# EAGLE schematic Board (EAGLE 6.5.0)
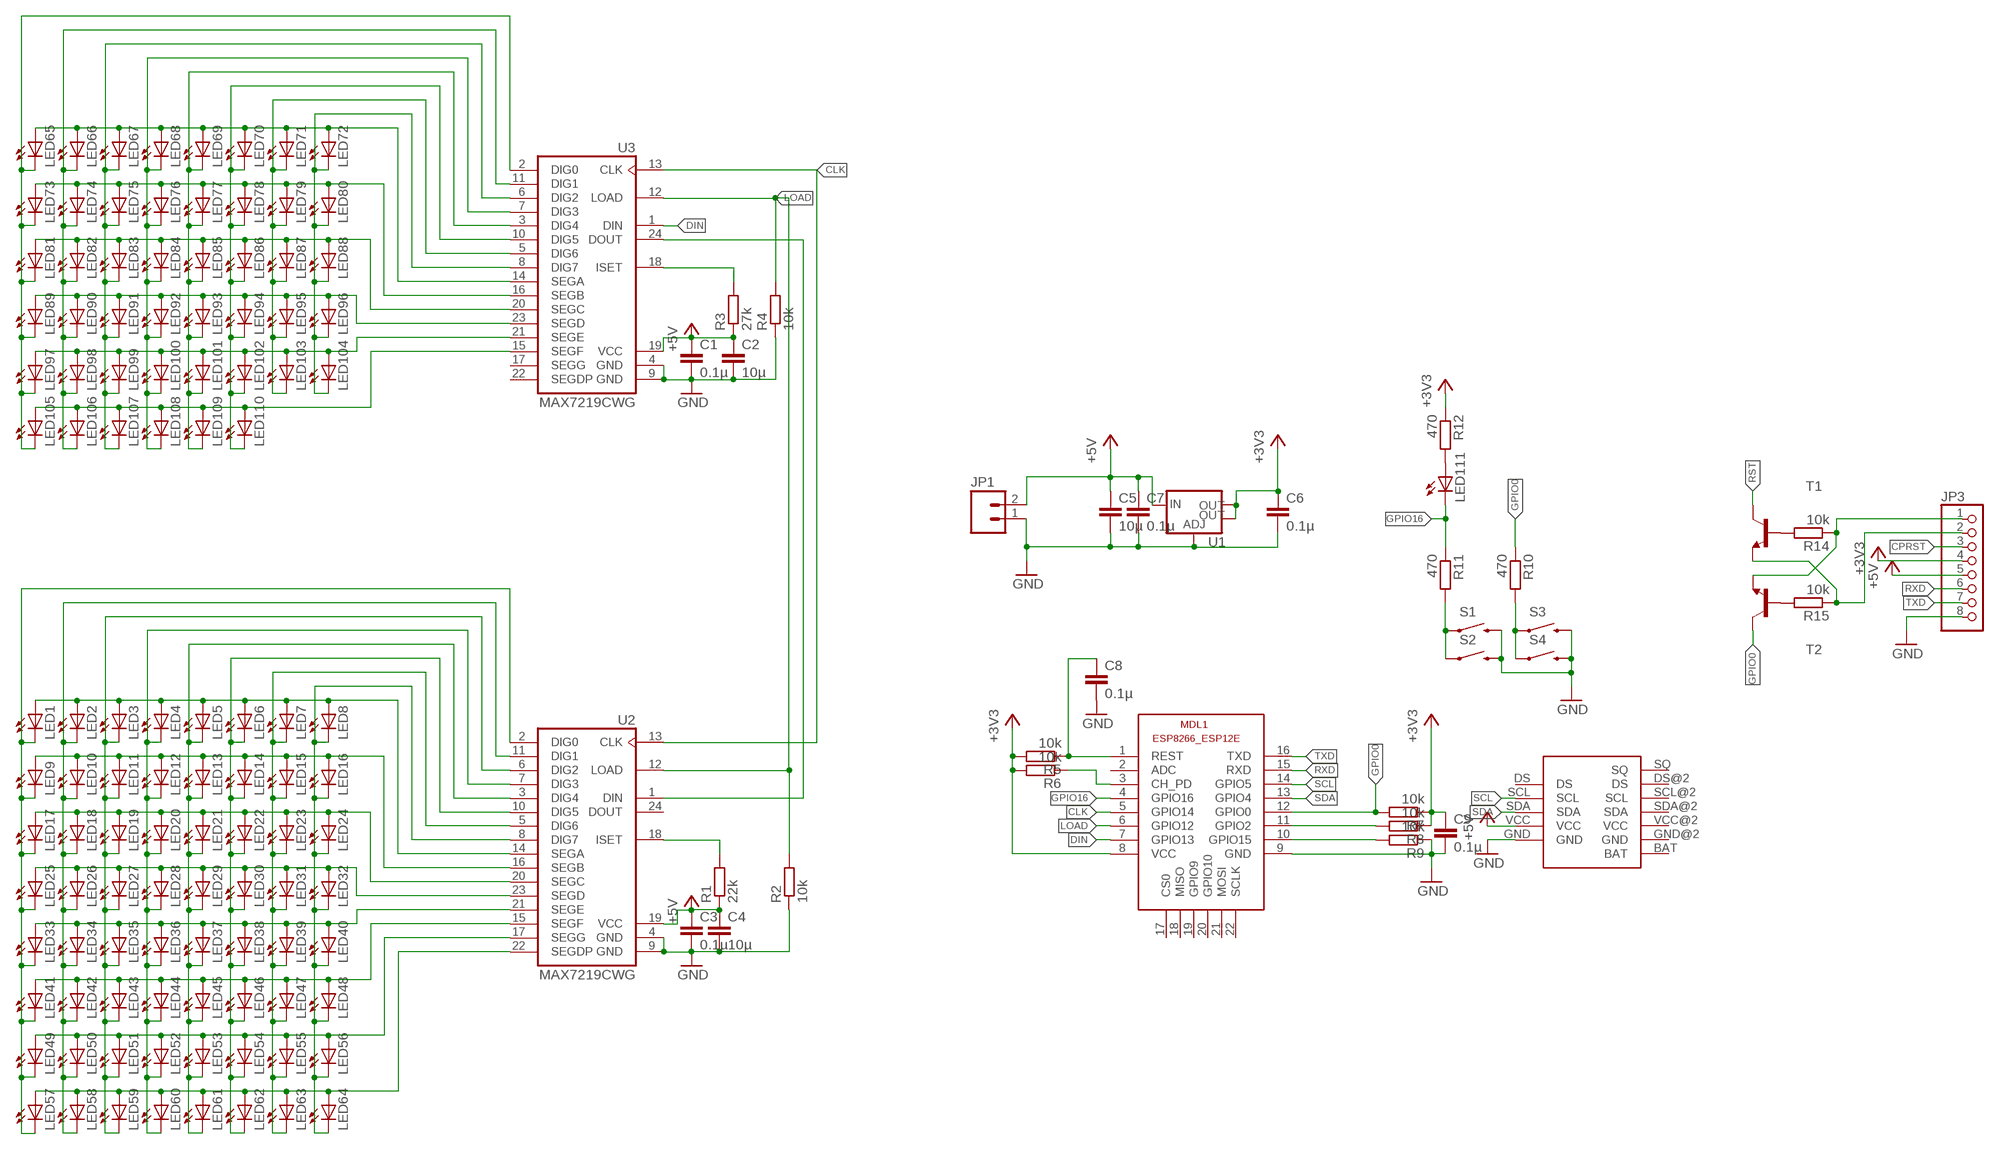
[diagram p0: schematic, sheet 1]

## Parts
C1  0.1µ  C-EUC0603  [C0603]
C2  10µ  C-EUC0603  [C0603]
C3  0.1µ  C-EUC0603  [C0603]
C4  10µ  C-EUC0603  [C0603]
C5  10µ  C-EUC0603  [C0603]
C6  0.1µ  C-EUC0603  [C0603]
C7  0.1µ  C-EUC0603  [C0603]
C8  0.1µ  C-EUC0603  [C0603]
C9  0.1µ  C-EUC0603  [C0603]
JP1  M02POLAR  [MOLEX-1X2]
JP3  PINHD-1X8  [1X08]
LED1  LEDCHIPLED_0805  [CHIPLED_0805]
LED2  LEDCHIPLED_0805  [CHIPLED_0805]
LED3  LEDCHIPLED_0805  [CHIPLED_0805]
LED4  LEDCHIPLED_0805  [CHIPLED_0805]
LED5  LEDCHIPLED_0805  [CHIPLED_0805]
LED6  LEDCHIPLED_0805  [CHIPLED_0805]
LED7  LEDCHIPLED_0805  [CHIPLED_0805]
LED8  LEDCHIPLED_0805  [CHIPLED_0805]
LED9  LEDCHIPLED_0805  [CHIPLED_0805]
LED10  LEDCHIPLED_0805  [CHIPLED_0805]
LED11  LEDCHIPLED_0805  [CHIPLED_0805]
LED12  LEDCHIPLED_0805  [CHIPLED_0805]
LED13  LEDCHIPLED_0805  [CHIPLED_0805]
LED14  LEDCHIPLED_0805  [CHIPLED_0805]
LED15  LEDCHIPLED_0805  [CHIPLED_0805]
LED16  LEDCHIPLED_0805  [CHIPLED_0805]
LED17  LEDCHIPLED_0805  [CHIPLED_0805]
LED18  LEDCHIPLED_0805  [CHIPLED_0805]
LED19  LEDCHIPLED_0805  [CHIPLED_0805]
LED20  LEDCHIPLED_0805  [CHIPLED_0805]
LED21  LEDCHIPLED_0805  [CHIPLED_0805]
LED22  LEDCHIPLED_0805  [CHIPLED_0805]
LED23  LEDCHIPLED_0805  [CHIPLED_0805]
LED24  LEDCHIPLED_0805  [CHIPLED_0805]
LED25  LEDCHIPLED_0805  [CHIPLED_0805]
LED26  LEDCHIPLED_0805  [CHIPLED_0805]
LED27  LEDCHIPLED_0805  [CHIPLED_0805]
LED28  LEDCHIPLED_0805  [CHIPLED_0805]
LED29  LEDCHIPLED_0805  [CHIPLED_0805]
LED30  LEDCHIPLED_0805  [CHIPLED_0805]
LED31  LEDCHIPLED_0805  [CHIPLED_0805]
LED32  LEDCHIPLED_0805  [CHIPLED_0805]
LED33  LEDCHIPLED_0805  [CHIPLED_0805]
LED34  LEDCHIPLED_0805  [CHIPLED_0805]
LED35  LEDCHIPLED_0805  [CHIPLED_0805]
LED36  LEDCHIPLED_0805  [CHIPLED_0805]
LED37  LEDCHIPLED_0805  [CHIPLED_0805]
LED38  LEDCHIPLED_0805  [CHIPLED_0805]
LED39  LEDCHIPLED_0805  [CHIPLED_0805]
LED40  LEDCHIPLED_0805  [CHIPLED_0805]
LED41  LEDCHIPLED_0805  [CHIPLED_0805]
LED42  LEDCHIPLED_0805  [CHIPLED_0805]
LED43  LEDCHIPLED_0805  [CHIPLED_0805]
LED44  LEDCHIPLED_0805  [CHIPLED_0805]
LED45  LEDCHIPLED_0805  [CHIPLED_0805]
LED46  LEDCHIPLED_0805  [CHIPLED_0805]
LED47  LEDCHIPLED_0805  [CHIPLED_0805]
LED48  LEDCHIPLED_0805  [CHIPLED_0805]
LED49  LEDCHIPLED_0805  [CHIPLED_0805]
LED50  LEDCHIPLED_0805  [CHIPLED_0805]
LED51  LEDCHIPLED_0805  [CHIPLED_0805]
LED52  LEDCHIPLED_0805  [CHIPLED_0805]
LED53  LEDCHIPLED_0805  [CHIPLED_0805]
LED54  LEDCHIPLED_0805  [CHIPLED_0805]
LED55  LEDCHIPLED_0805  [CHIPLED_0805]
LED56  LEDCHIPLED_0805  [CHIPLED_0805]
LED57  LEDCHIPLED_0805  [CHIPLED_0805]
LED58  LEDCHIPLED_0805  [CHIPLED_0805]
LED59  LEDCHIPLED_0805  [CHIPLED_0805]
LED60  LEDCHIPLED_0805  [CHIPLED_0805]
LED61  LEDCHIPLED_0805  [CHIPLED_0805]
LED62  LEDCHIPLED_0805  [CHIPLED_0805]
LED63  LEDCHIPLED_0805  [CHIPLED_0805]
LED64  LEDCHIPLED_0805  [CHIPLED_0805]
LED65  LEDCHIPLED_0805  [CHIPLED_0805]
LED66  LEDCHIPLED_0805  [CHIPLED_0805]
LED67  LEDCHIPLED_0805  [CHIPLED_0805]
LED68  LEDCHIPLED_0805  [CHIPLED_0805]
LED69  LEDCHIPLED_0805  [CHIPLED_0805]
LED70  LEDCHIPLED_0805  [CHIPLED_0805]
LED71  LEDCHIPLED_0805  [CHIPLED_0805]
LED72  LEDCHIPLED_0805  [CHIPLED_0805]
LED73  LEDCHIPLED_0805  [CHIPLED_0805]
LED74  LEDCHIPLED_0805  [CHIPLED_0805]
LED75  LEDCHIPLED_0805  [CHIPLED_0805]
LED76  LEDCHIPLED_0805  [CHIPLED_0805]
LED77  LEDCHIPLED_0805  [CHIPLED_0805]
LED78  LEDCHIPLED_0805  [CHIPLED_0805]
LED79  LEDCHIPLED_0805  [CHIPLED_0805]
LED80  LEDCHIPLED_0805  [CHIPLED_0805]
LED81  LEDCHIPLED_0805  [CHIPLED_0805]
LED82  LEDCHIPLED_0805  [CHIPLED_0805]
LED83  LEDCHIPLED_0805  [CHIPLED_0805]
LED84  LEDCHIPLED_0805  [CHIPLED_0805]
LED85  LEDCHIPLED_0805  [CHIPLED_0805]
LED86  LEDCHIPLED_0805  [CHIPLED_0805]
LED87  LEDCHIPLED_0805  [CHIPLED_0805]
LED88  LEDCHIPLED_0805  [CHIPLED_0805]
LED89  LEDCHIPLED_0805  [CHIPLED_0805]
LED90  LEDCHIPLED_0805  [CHIPLED_0805]
LED91  LEDCHIPLED_0805  [CHIPLED_0805]
LED92  LEDCHIPLED_0805  [CHIPLED_0805]
LED93  LEDCHIPLED_0805  [CHIPLED_0805]
LED94  LEDCHIPLED_0805  [CHIPLED_0805]
LED95  LEDCHIPLED_0805  [CHIPLED_0805]
LED96  LEDCHIPLED_0805  [CHIPLED_0805]
LED97  LEDCHIPLED_0805  [CHIPLED_0805]
LED98  LEDCHIPLED_0805  [CHIPLED_0805]
LED99  LEDCHIPLED_0805  [CHIPLED_0805]
LED100  LEDCHIPLED_0805  [CHIPLED_0805]
LED101  LEDCHIPLED_0805  [CHIPLED_0805]
LED102  LEDCHIPLED_0805  [CHIPLED_0805]
LED103  LEDCHIPLED_0805  [CHIPLED_0805]
LED104  LEDCHIPLED_0805  [CHIPLED_0805]
LED105  LEDCHIPLED_0805  [CHIPLED_0805]
LED106  LEDCHIPLED_0805  [CHIPLED_0805]
LED107  LEDCHIPLED_0805  [CHIPLED_0805]
LED108  LEDCHIPLED_0805  [CHIPLED_0805]
LED109  LEDCHIPLED_0805  [CHIPLED_0805]
LED110  LEDCHIPLED_0805  [CHIPLED_0805]
LED111  LEDCHIPLED_0805  [CHIPLED_0805]
MDL1  ESP8266-12EESP8266-ESP12E  [ESP8266-ESP12E]
R1  22k  R-EU_R0603  [R0603]
R2  10k  R-EU_R0603  [R0603]
R3  27k  R-EU_R0603  [R0603]
R4  10k  R-EU_R0603  [R0603]
R5  10k  R-EU_R0603  [R0603]
R6  10k  R-EU_R0603  [R0603]
R7  10k  R-EU_R0603  [R0603]
R8  10k  R-EU_R0603  [R0603]
R9  10k  R-EU_R0603  [R0603]
R10  470  R-EU_R0603  [R0603]
R11  470  R-EU_R0603  [R0603]
R12  470  R-EU_R0603  [R0603]
R14  10k  R-EU_R0603  [R0603]
R15  10k  R-EU_R0603  [R0603]
S1  SWITCH-MOMENTARY-2SIDE_EZ  [TACTILE-PTH-SIDEEZ]
S2  SWITCH-MOMENTARY-2SMD-1101NE  [TACTILE-SWITCH-1101NE]
S3  SWITCH-MOMENTARY-2SIDE_EZ  [TACTILE-PTH-SIDEEZ]
S4  SWITCH-MOMENTARY-2SMD-1101NE  [TACTILE-SWITCH-1101NE]
T1  BC847-NPN-SOT23-BEC  [SOT23-BEC]
T2  BC847-NPN-SOT23-BEC  [SOT23-BEC]
U1  V_REG_LM1117SOT223  [SOT223]
U2  MAX7219CWG  [SO24L]
U3  MAX7219CWG  [SO24L]
U$3  DS1307-MODULE  [DS1307-MODULE]

## Nets
+3V3: C6.1 C9.1 JP3.4 MDL1.8(VCC) R5.2 R6.2 R7.1 R8.1 R12.1 U1.2(OUT) U1.4(OUT)
+5V: C1.1 C2.1 C3.1 C4.1 C5.1 C7.1 JP1.2 JP3.5 R1.1 R3.1 U1.3(IN) U2.19(VCC) U3.19(VCC) U$3.VCC
CLK: MDL1.5(GPIO14) U2.13(CLK) U3.13(CLK)
CPRST: JP3.3
DIN: MDL1.7(GPIO13) U3.1(DIN)
DTR: JP3.1 R14.1 T2.E
GND: C1.2 C2.2 C3.2 C4.2 C5.2 C6.2 C7.2 C8.2 C9.2 JP1.1 JP3.8 MDL1.9(GND) R2.1 R4.1 R9.1 S1.2 S2.2 S3.2 S4.2 U1.1(ADJ) U2.4(GND) U2.9(GND) U3.4(GND) U3.9(GND) U$3.GND
GPIO0: MDL1.12(GPIO0) R7.2 R10.1 T2.C
GPIO16: LED111.C MDL1.4(GPIO16) R11.1
LOAD: MDL1.6(GPIO12) R2.2 R4.2 U2.12(LOAD) U3.12(LOAD)
N$1: LED1.C LED9.C LED17.C LED25.C LED33.C LED41.C LED49.C LED57.C U2.2(DIG0)
N$2: LED2.C LED10.C LED18.C LED26.C LED34.C LED42.C LED50.C LED58.C U2.11(DIG1)
N$3: LED9.A LED10.A LED11.A LED12.A LED13.A LED14.A LED15.A LED16.A U2.16(SEGB)
N$4: LED17.A LED18.A LED19.A LED20.A LED21.A LED22.A LED23.A LED24.A U2.20(SEGC)
N$5: LED3.C LED11.C LED19.C LED27.C LED35.C LED43.C LED51.C LED59.C U2.6(DIG2)
N$6: LED4.C LED12.C LED20.C LED28.C LED36.C LED44.C LED52.C LED60.C U2.7(DIG3)
N$7: LED5.C LED13.C LED21.C LED29.C LED37.C LED45.C LED53.C LED61.C U2.3(DIG4)
N$8: LED6.C LED14.C LED22.C LED30.C LED38.C LED46.C LED54.C LED62.C U2.10(DIG5)
N$9: LED7.C LED15.C LED23.C LED31.C LED39.C LED47.C LED55.C LED63.C U2.5(DIG6)
N$10: LED8.C LED16.C LED24.C LED32.C LED40.C LED48.C LED56.C LED64.C U2.8(DIG7)
N$11: LED1.A LED2.A LED3.A LED4.A LED5.A LED6.A LED7.A LED8.A U2.14(SEGA)
N$12: LED25.A LED26.A LED27.A LED28.A LED29.A LED30.A LED31.A LED32.A U2.23(SEGD)
N$13: LED33.A LED34.A LED35.A LED36.A LED37.A LED38.A LED39.A LED40.A U2.21(SEGE)
N$14: LED41.A LED42.A LED43.A LED44.A LED45.A LED46.A LED47.A LED48.A U2.15(SEGF)
N$15: LED49.A LED50.A LED51.A LED52.A LED53.A LED54.A LED55.A LED56.A U2.17(SEGG)
N$16: LED57.A LED58.A LED59.A LED60.A LED61.A LED62.A LED63.A LED64.A U2.22(SEGDP)
N$17: LED66.C LED74.C LED82.C LED90.C LED98.C LED106.C U3.11(DIG1)
N$18: LED65.C LED73.C LED81.C LED89.C LED97.C LED105.C U3.2(DIG0)
N$19: LED67.C LED75.C LED83.C LED91.C LED99.C LED107.C U3.6(DIG2)
N$20: LED68.C LED76.C LED84.C LED92.C LED100.C LED108.C U3.7(DIG3)
N$21: LED69.C LED77.C LED85.C LED93.C LED101.C LED109.C U3.3(DIG4)
N$22: LED70.C LED78.C LED86.C LED94.C LED102.C LED110.C U3.10(DIG5)
N$23: LED71.C LED79.C LED87.C LED95.C LED103.C U3.5(DIG6)
N$24: LED72.C LED80.C LED88.C LED96.C LED104.C U3.8(DIG7)
N$25: LED65.A LED66.A LED67.A LED68.A LED69.A LED70.A LED71.A LED72.A U3.14(SEGA)
N$26: LED73.A LED74.A LED75.A LED76.A LED77.A LED78.A LED79.A LED80.A U3.16(SEGB)
N$27: LED81.A LED82.A LED83.A LED84.A LED85.A LED86.A LED87.A LED88.A U3.20(SEGC)
N$28: LED89.A LED90.A LED91.A LED92.A LED93.A LED94.A LED95.A LED96.A U3.23(SEGD)
N$29: LED97.A LED98.A LED99.A LED100.A LED101.A LED102.A LED103.A LED104.A U3.21(SEGE)
N$30: LED105.A LED106.A LED107.A LED108.A LED109.A LED110.A U3.15(SEGF)
N$32: R10.2 S3.1 S4.1
N$34: R14.2 T1.B
N$35: U2.1(DIN) U3.24(DOUT)
N$36: MDL1.3(CH_PD) R6.1
N$38: R15.2 T2.B
N$39: LED111.A R12.2
N$40: MDL1.11(GPIO2) R8.2
N$41: R3.2 U3.18(ISET)
N$42: MDL1.10(GPIO15) R9.2
N$43: R1.2 U2.18(ISET)
N$45: R11.2 S1.1 S2.1
RST: C8.1 MDL1.1(REST) R5.1 T1.C
RTS: JP3.2 R15.1 T1.E
RXD: JP3.6 MDL1.15(RXD)
SCL: MDL1.14(GPIO5) U$3.SCL
SDA: MDL1.13(GPIO4) U$3.SDA
TXD: JP3.7 MDL1.16(TXD)
Unconnected: MDL1.2(ADC) MDL1.17(CS0) MDL1.18(MISO) MDL1.19(GPIO9) MDL1.20(GPIO10) MDL1.21(MOSI) MDL1.22(SCLK) U2.24(DOUT) U3.17(SEGG) U3.22(SEGDP) U$3.BAT U$3.DS U$3.DS@2(DS) U$3.GND@2(GND) U$3.SCL@2(SCL) U$3.SDA@2(SDA) U$3.SQ U$3.VCC@2(VCC)

## Library data of the parts
C1-C9 = rcl:C-EU: CAPACITOR, European symbol
JP1 = SparkFun-Connectors:M02: Standard 2-pin 0.1" header. Use with - straight break away headers ( PRT-00116) - right angle break away headers (PRT-00553) - swiss pins (PRT-00743) - machine pins (PRT-00117) - female headers (PRT-00115) Molex polarized connector foot print use with: PRT-08233 with associated crimp pins and housings. 2.54_SCREWTERM for use with PRT-10571. 3.5mm Screw Terminal footprints for PRT-08084 5mm Screw Terminal footprints for use with PRT-08432
JP3 = pinhead:PINHD-1X8: PIN HEADER
LED1-LED111 = led:LED: LED OSRAM: - CHIPLED LG R971, LG N971, LY N971, LG Q971, LY Q971, LO R971, LY R971 LH N974, LH R974 LS Q976, LO Q976, LY Q976 LO Q996 - Hyper CHIPLED LW Q18S LB Q993, LB Q99A, LB R99A - SideLED LS A670, LO A670, LY A670, LG A670, LP A670 LB A673, LV A673, LT A673, LW A673 LH A674 LY A675 LS A676, LA A676, LO A676, LY A676, LW A676 LS A679, LY A679, LG A679 - Hyper Micro SIDELED® LS Y876, LA Y876, LO Y876, LY Y876 LT Y87S - SmartLED LW L88C, LW L88S LB L89C, LB L89S, LG L890 LS L89K, LO L89K, LY L89K LS L896, LA L896, LO L896, LY L896 - TOPLED LS T670, LO T670, LY T670, LG T670, LP T670 LSG T670, LSP T670, LSY T670, LOP T670, LYG T670 LG T671, LOG T671, LSG T671 LB T673, LV T673, LT T673, LW T673 LH T674 LS T676, LA T676, LO T676, LY T676, LB T676, LH T676, LSB T676, LW T676 LB T67C, LV T67C, LT T67C, LS T67K, LO T67K, LY T67K, LW E67C LS E67B, LA E67B, LO E67B, LY E67B, LB E67C, LV E67C, LT E67C LW T67C LS T679, LY T679, LG T679 LS T770, LO T770, LY T770, LG T770, LP T770 LB T773, LV T773, LT T773, LW T773 LH T774 LS E675, LA E675, LY E675, LS T675 LS T776, LA T776, LO T776, LY T776, LB T776 LHGB T686 LT T68C, LB T68C - Hyper Mini TOPLED® LB M676 - Mini TOPLED Santana® LG M470 LS M47K, LO M47K, LY M47K Source: http://www.osram.convergy.de LUXEON: - LUMILED® LXK2-PW12-R00, LXK2-PW12-S00, LXK2-PW14-U00, LXK2-PW14-V00 LXK2-PM12-R00, LXK2-PM12-S00, LXK2-PM14-U00 LXK2-PE12-Q00, LXK2-PE12-R00, LXK2-PE12-S00, LXK2-PE14-T00, LXK2-PE14-U00 LXK2-PB12-K00, LXK2-PB12-L00, LXK2-PB12-M00, LXK2-PB14-N00, LXK2-PB14-P00, LXK2-PB14-Q00 LXK2-PR12-L00, LXK2-PR12-M00, LXK2-PR14-Q00, LXK2-PR14-R00 LXK2-PD12-Q00, LXK2-PD12-R00, LXK2-PD12-S00 LXK2-PH12-R00, LXK2-PH12-S00 LXK2-PL12-P00, LXK2-PL12-Q00, LXK2-PL12-R00 Source: www.luxeon.com KINGBRIGHT: KA-3528ASYC Source: www.kingbright.com
MDL1 = ESP8266-ESP12E:ESP8266-12E: ESP8266-12E with additional I/O and GPIO04/05 corrected The author cannot warrant that this library is free from error or will meet your specific requirements. Created by PuceBaboon.com. Komagane, Nagano, JAPAN
R1-R12 R14 R15 = rcl:R-EU_: RESISTOR, European symbol
S1 S3 = SparkFun-Electromechanical:SWITCH-MOMENTARY-2: Various NO switches- pushbuttons, reed, etc
S2 S4 = SparkFun-Electromechanical:SWITCH-MOMENTARY-2: Various NO switches- pushbuttons, reed, etc; PROD_ID: SWCH-00815
T1 T2 = transistor:*-NPN-: NPN Transistror BF959 corrected 2008.03.06
U1 = SparkFun-PowerIC:V_REG_LM1117: Voltage Regulator LM1117 Standard adjustable voltage regulator but in SMD form. Spark Fun Electronics SKU : COM-00595; PROD_ID: VREG-08170
U2 U3 = max7219:MAX7219CWG
U$3 = OwnStuff:DS1307-MODULE